# EAGLE design propdev (EAGLE 7.4.0)
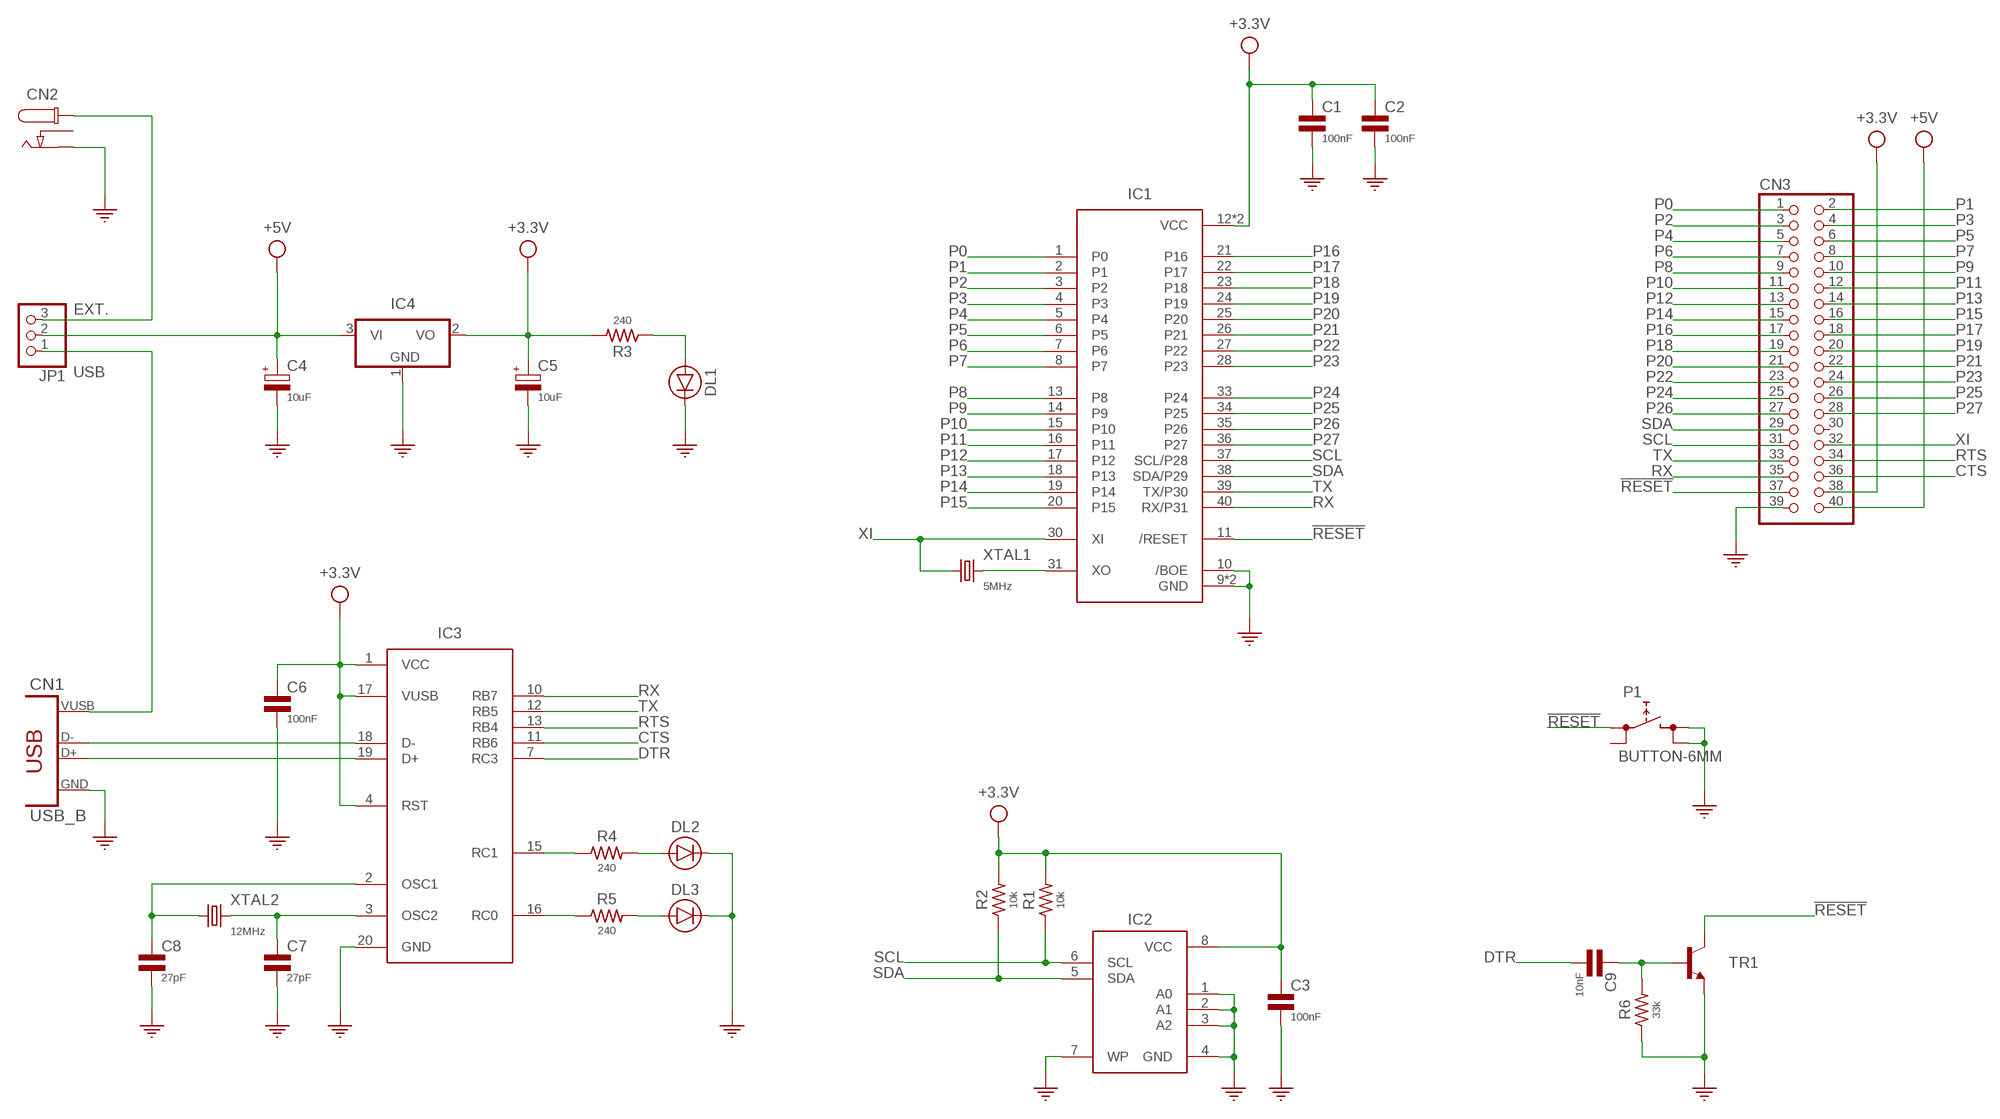
[diagram p0: schematic, sheet 1]

## Parts
C1  100nF  C  [C050-025X075]
C2  100nF  C  [C050-025X075]
C3  100nF  C  [C050-025X075]
C4  10uF  CP-2.5-6  [E2,5-6]
C5  10uF  CP-2.5-6  [E2,5-6]
C6  100nF  C  [C050-025X075]
C7  27pF  C  [C050-025X075]
C8  27pF  C  [C050-025X075]
C9  10nF  C  [C050-025X075]
CN1  USB_B  [USB-B]
CN2  DC_JACK  [PJ-102A]
CN3  PINHD-2X20B  [2X20B]
DL1  LED-3MM  [LED3MM]
DL2  LED-3MM  [LED3MM]
DL3  LED-3MM  [LED3MM]
IC1  P8X32A  [DIL40]
IC2  24LC512-I/P  [DIL08]
IC3  PIC18F14K50-I/P  [DIL20]
IC4  LM1117T-3.3  LM1117T  [TO220H]
JP1  PINHD-1X3  [1X03]
P1  BUTTON-6MM  [TL1105]
R1  10k  R-1/4W  [0207/10]
R2  10k  R-1/4W  [0207/10]
R3  240  R-1/4W  [0207/10]
R4  240  R-1/4W  [0207/10]
R5  240  R-1/4W  [0207/10]
R6  33k  R-1/4W  [0207/10]
TR1  BC547  [TO92]
XTAL1  5MHz  CRYSTAL-HC49/S  [HC49/S]
XTAL2  12MHz  CRYSTAL-HC49/S  [HC49/S]

## Nets
!RESET!: CN3.37 IC1.11(/RESET) P1.1 TR1.3(C)
+3.3V: C1.1 C2.1 C3.1 C5.+ C6.1 CN3.38 IC1.12(VCC) IC1.32(VCC) IC2.8(VCC) IC3.1(VCC) IC3.4(RST) IC3.17(VUSB) IC4.2(VO) R1.2 R2.2 R3.2
+5V: C4.+ CN3.40 IC4.3(VI) JP1.2
CTS: CN3.36 IC3.11(RB6)
DTR: C9.2 IC3.7(RC3)
EXT.: CN2.P1 JP1.3
GND: C1.2 C2.2 C3.2 C4.- C5.- C6.2 C7.2 C8.2 CN1.4(GND) CN2.P3(P2) CN3.39 DL1.K(C) DL2.K(C) DL3.K(C) IC1.9(GND) IC1.10(/BOE) IC1.29(GND) IC2.1(A0) IC2.2(A1) IC2.3(A2) IC2.4(GND) IC2.7(WP) IC3.20(GND) IC4.1(GND) P1.2 P1.4 R6.1 TR1.1(E)
N$1: IC3.16(RC0) R5.1
N$2: CN1.2(D-) IC3.18(D-)
N$3: CN1.3(D+) IC3.19(D+)
N$4: C7.1 IC3.3(OSC2) XTAL2.2
N$5: C8.1 IC3.2(OSC1) XTAL2.1
N$6: C9.1 R6.2 TR1.2(B)
N$7: DL2.A R4.2
N$8: DL3.A R5.2
N$9: IC3.15(RC1) R4.1
N$11: DL1.A R3.1
N$25: IC1.31(XO) XTAL1.2
P0: CN3.1 IC1.1(P0)
P1: CN3.2 IC1.2(P1)
P2: CN3.3 IC1.3(P2)
P3: CN3.4 IC1.4(P3)
P4: CN3.5 IC1.5(P4)
P5: CN3.6 IC1.6(P5)
P6: CN3.7 IC1.7(P6)
P7: CN3.8 IC1.8(P7)
P8: CN3.9 IC1.13(P8)
P9: CN3.10 IC1.14(P9)
P10: CN3.11 IC1.15(P10)
P11: CN3.12 IC1.16(P11)
P12: CN3.13 IC1.17(P12)
P13: CN3.14 IC1.18(P13)
P14: CN3.15 IC1.19(P14)
P15: CN3.16 IC1.20(P15)
P16: CN3.17 IC1.21(P16)
P17: CN3.18 IC1.22(P17)
P18: CN3.19 IC1.23(P18)
P19: CN3.20 IC1.24(P19)
P20: CN3.21 IC1.25(P20)
P21: CN3.22 IC1.26(P21)
P22: CN3.23 IC1.27(P22)
P23: CN3.24 IC1.28(P23)
P24: CN3.25 IC1.33(P24)
P25: CN3.26 IC1.34(P25)
P26: CN3.27 IC1.35(P26)
P27: CN3.28 IC1.36(P27)
RTS: CN3.34 IC3.13(RB4)
RX: CN3.35 IC1.40(RX/P31) IC3.10(RB7)
SCL: CN3.31 IC1.37(SCL/P28) IC2.6(SCL) R1.1
SDA: CN3.29 IC1.38(SDA/P29) IC2.5(SDA) R2.1
TX: CN3.33 IC1.39(TX/P30) IC3.12(RB5)
USB: CN1.1(VUSB) JP1.1
XI: CN3.32 IC1.30(XI) XTAL1.1
Unconnected: CN2.P2(P3) CN3.30 P1.3

## Library data of the parts
C1-C3 C6-C9 = propdev-2016:C
C4 C5 = propdev-2016:CP
CN1 = propdev-2016:USB_B: MINI USB 4 Pol.
CN2 = propdev-2016:DC_JACK: DC power connector
CN3 = propdev-2016:PINHD-2X20: PIN HEADER
DL1-DL3 = propdev-2016:LED: LED
IC1 = propdev-2016:P8X32A: Parallax Propeller
IC2 = propdev-2016:24LC*
IC3 = propdev-2016:PIC18F14K50: PIC18F14K50
IC4 = propdev-2016:LM1117
JP1 = propdev-2016:PINHD-1X3: PIN HEADER
P1 = propdev-2016:BUTTON
R1-R6 = propdev-2016:R
TR1 = propdev-2016:BC547*: NPN Transistor
XTAL1 XTAL2 = propdev-2016:CRYSTAL

## Board
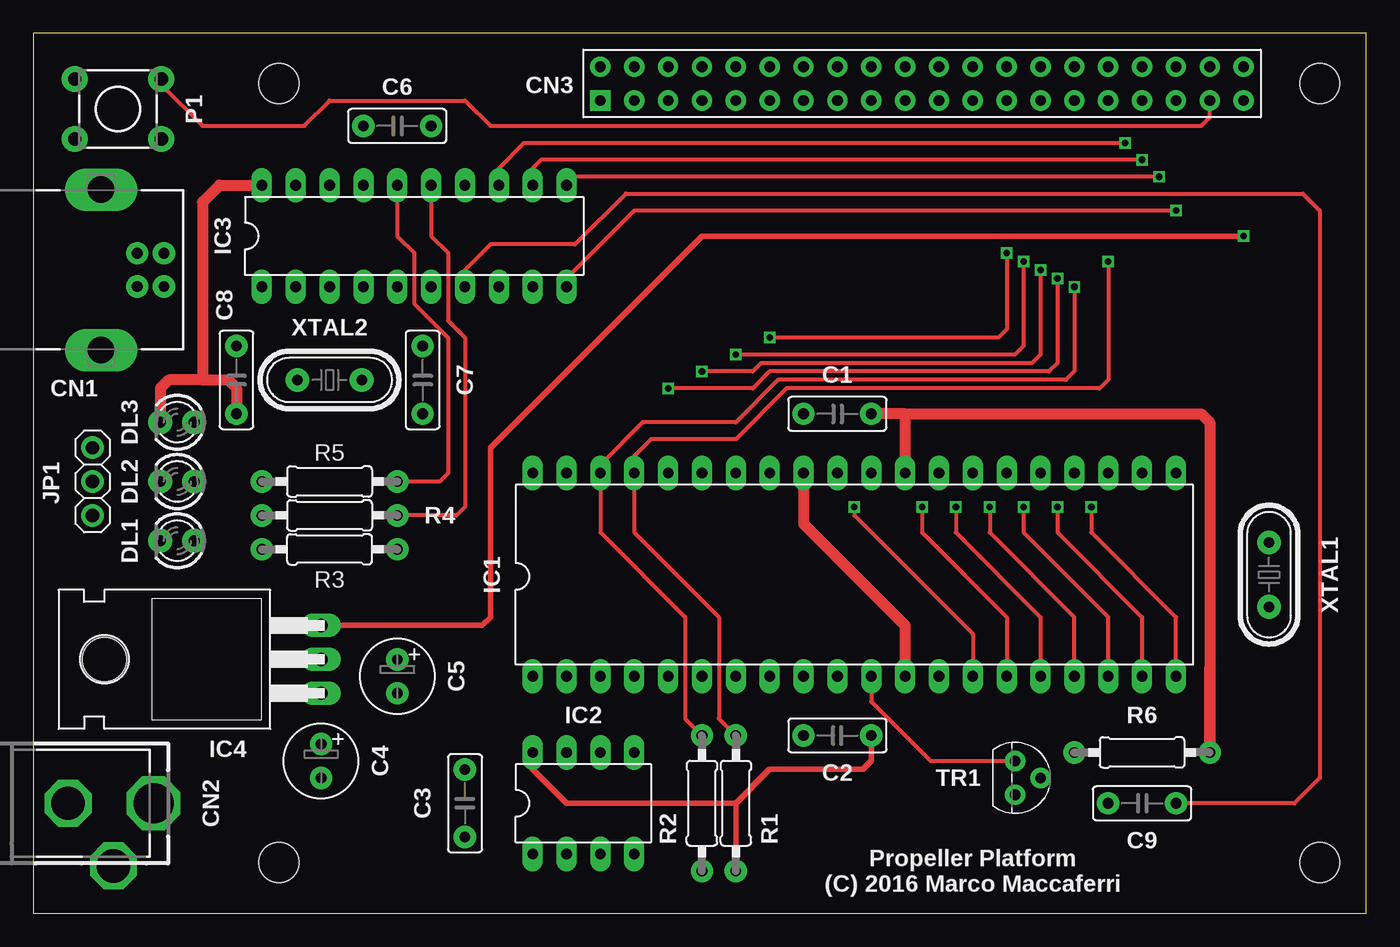
[diagram p1: board, top side]
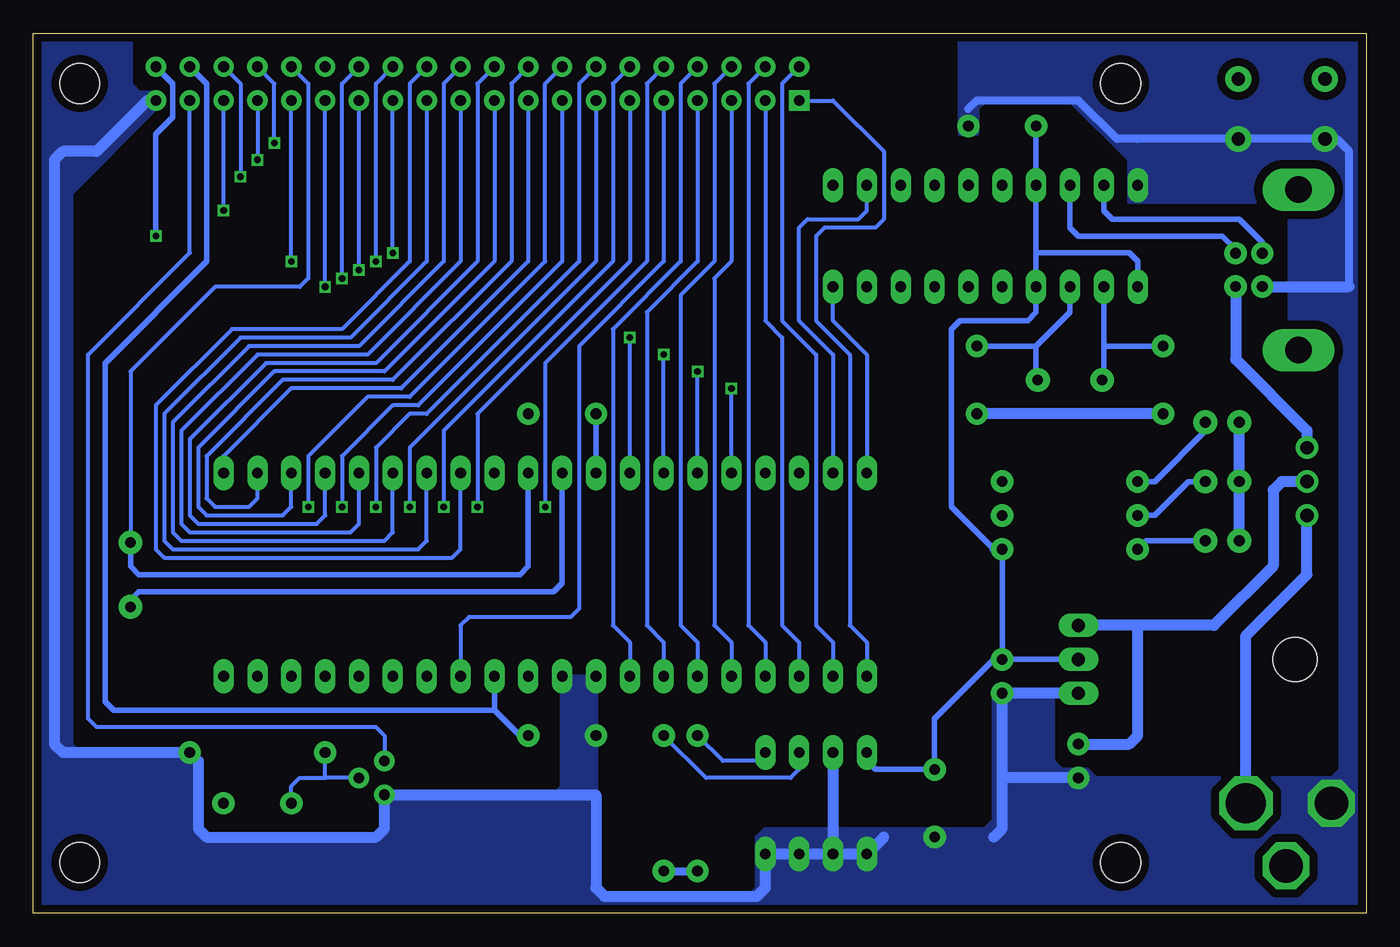
[diagram p2: board, bottom side, seen from below]

Size 100 x 66 mm. Coordinates in mm from the lower left corner, seen from the top.
Outline: 0,0 100,0 100,66 0,66 0,0
Copper layers (1*16): Top 0.0356mm / dielectric 1.5011mm / Bottom 0.0356mm
Design rules "oshpark-2layer": minimum track width 6mil, minimum drill 13mil, track to track 6mil, track to pad 6mil, pad to pad 6mil, via to via 6mil, smd to smd 6mil, copper to edge 15mil, drill to drill 6mil, minimum pad ring 7mil, minimum via ring 7mil, stop-mask expansion 2.5mil, vias tented up to drill 0mil, thermal gap 10mil
Holes 3 mm at 18.41,3.81 96.52,3.81 96.52,62.23 18.41,62.23

### Footprints (pad centres in the part's own frame; a part is rotated, then mirrored left to right if it is on the bottom)
C050-025X075 = drill 0.8 pad 1.676: 1 -2.54,0; 2 2.54,0
E2,5-6 = drill 0.8 pad 1.676: + -1.27,0; - 1.27,0
USB-B = drill 0.8 pad 1.676: 1 4.71,-1.25; 2 4.71,1.25; 3 2.71,1.25; 4 2.71,-1.25 | drill 2 pad 3.2 long: M1 0,6.02; M2 0,-6.02
PJ-102A = drill 3 octagon: P1 0,6.475 | drill 2.5 octagon: P2 4.7,3.475; P3 0,0.065
2X20B = drill 0.8 pad 1.524 square: 1 -24.13,-1.27 | drill 0.8 pad 1.524: 2 -24.13,1.27; 3 -21.59,-1.27; 4 -21.59,1.27; 5 -19.05,-1.27; 6 -19.05,1.27; 7 -16.51,-1.27; 8 -16.51,1.27; 9 -13.97,-1.27; 10 -13.97,1.27; 11 -11.43,-1.27; 12 -11.43,1.27; 13 -8.89,-1.27; 14 -8.89,1.27; 15 -6.35,-1.27; 16 -6.35,1.27; 17 -3.81,-1.27; 18 -3.81,1.27; 19 -1.27,-1.27; 20 -1.27,1.27; 21 1.27,-1.27; 22 1.27,1.27; 23 3.81,-1.27; 24 3.81,1.27; 25 6.35,-1.27; 26 6.35,1.27; 27 8.89,-1.27; 28 8.89,1.27; 29 11.43,-1.27; 30 11.43,1.27; 31 13.97,-1.27; 32 13.97,1.27; 33 16.51,-1.27; 34 16.51,1.27; 35 19.05,-1.27; 36 19.05,1.27; 37 21.59,-1.27; 38 21.59,1.27; 39 24.13,-1.27; 40 24.13,1.27
LED3MM = drill 0.8 pad 1.778: A -1.27,0; K 1.27,0
DIL40 = drill 0.8 pad 1.524 long: 1 -24.13,-7.62; 2 -21.59,-7.62; 3 -19.05,-7.62; 4 -16.51,-7.62; 5 -13.97,-7.62; 6 -11.43,-7.62; 7 -8.89,-7.62; 8 -6.35,-7.62; 9 -3.81,-7.62; 10 -1.27,-7.62; 11 1.27,-7.62; 12 3.81,-7.62; 13 6.35,-7.62; 14 8.89,-7.62; 15 11.43,-7.62; 16 13.97,-7.62; 17 16.51,-7.62; 18 19.05,-7.62; 19 21.59,-7.62; 20 24.13,-7.62; 21 24.13,7.62; 22 21.59,7.62; 23 19.05,7.62; 24 16.51,7.62; 25 13.97,7.62; 26 11.43,7.62; 27 8.89,7.62; 28 6.35,7.62; 29 3.81,7.62; 30 1.27,7.62; 31 -1.27,7.62; 32 -3.81,7.62; 33 -6.35,7.62; 34 -8.89,7.62; 35 -11.43,7.62; 36 -13.97,7.62; 37 -16.51,7.62; 38 -19.05,7.62; 39 -21.59,7.62; 40 -24.13,7.62
DIL08 = drill 0.8 pad 1.524 long: 1 -3.81,-3.81; 2 -1.27,-3.81; 3 1.27,-3.81; 4 3.81,-3.81; 5 3.81,3.81; 6 1.27,3.81; 7 -1.27,3.81; 8 -3.81,3.81
DIL20 = drill 0.8 pad 1.524 long: 1 -11.43,-3.81; 2 -8.89,-3.81; 3 -6.35,-3.81; 4 -3.81,-3.81; 5 -1.27,-3.81; 6 1.27,-3.81; 7 3.81,-3.81; 8 6.35,-3.81; 9 8.89,-3.81; 10 11.43,-3.81; 11 11.43,3.81; 12 8.89,3.81; 13 6.35,3.81; 14 3.81,3.81; 15 1.27,3.81; 16 -1.27,3.81; 17 -3.81,3.81; 18 -6.35,3.81; 19 -8.89,3.81; 20 -11.43,3.81
TO220H = drill 1 pad 1.778 long: 1 -2.54,-11.43; 2 0,-11.43; 3 2.54,-11.43 | hole 3.302: 0,4.826
1X03 = drill 1 pad 1.676: 1 -2.54,0; 2 0,0; 3 2.54,0
TL1105 = drill 1 pad 1.93: 1 -3.25,-2.25; 2 -3.25,2.25; 3 3.25,-2.25; 4 3.25,2.25
0207/10 = drill 0.8 pad 1.676: 1 -5.08,0; 2 5.08,0
TO92 = drill 0.8 pad 1.524: 1 1.27,0; 2 0,1.905; 3 -1.27,0
HC49/S = drill 0.8 pad 1.778: 1 -2.413,0; 2 2.413,0

### Placement (x,y rotation side)
C1  60.33,37.47 0 top
C2  60.33,13.34 180 top
C3  32.38,8.26 270 top
C4  21.59,11.43 270 top
C5  27.3,17.78 270 top
C6  27.3,59.05 0 top
C7  29.21,40.01 270 top
C8  15.24,40.01 270 top
C9  83.19,8.26 0 top
CN1  5.08,48.26 0 top
CN2  2.54,8.26 270 top
CN3  66.67,62.23 0 top
DL1  10.79,27.94 180 top
DL2  10.79,32.38 180 top
DL3  10.79,36.83 180 top
IC1  61.59,25.4 0 top
IC2  41.27,8.26 0 top
IC3  28.57,50.8 0 top
IC4  10.16,19.05 90 top
JP1  4.45,32.38 270 top
P1  6.35,60.33 180 top
R1  52.7,8.26 270 top
R2  50.16,8.26 270 top
R3  22.23,27.3 0 top
R4  22.23,29.84 180 top
R5  22.23,32.38 180 top
R6  83.19,12.06 180 top
TR1  73.66,10.16 270 top
XTAL1  92.71,25.4 270 top
XTAL2  22.23,40.01 0 top

### Tracks (layer width: path | path; a pad name or v marks a point on that pad's centre or on a via)
!RESET!
  Top 0.305: P1.1 9.6,62.16 12.7,59.05 20.32,59.05 22.23,60.96 32.38,60.96 34.29,59.05 87.63,59.05 88.27,59.69 CN3.37 | IC1.11 62.87,15.88 67.31,11.43 TR1.3
  Bottom 0.305: CN3.37 88.27,49.53 95.89,41.91 95.89,14.61 95.25,13.97 74.3,13.97 73.66,13.34 TR1.3
+3.3V
  Top 0.406: 52.7,8.26 40.01,8.26 37.47,10.79 IC2.8 | R1.2 52.7,8.26 | 52.7,8.26 55.24,10.79 62.23,10.79 62.87,11.43 C2.1
  Top 0.813: IC1.32 57.78,29.21 65.41,21.59 IC1.12
  Bottom 0.406: 24.77,49.53 IC3.17 C6.1 | 24.77,49.53 IC3.4 24.77,45.09 25.4,44.45 30.48,44.45 31.11,43.81 31.11,30.48 27.94,27.3 | R3.2 C5.+ | 65.41,15.24 93.98,15.24 94.61,15.88 94.61,41.27 87,48.9 87,62.23 CN3.38 | IC4.2 C5.+ | 24.77,49.53 17.78,49.53 17.14,48.9 IC3.1 | C5.+ 27.94,19.05 32.38,14.61 C3.1 36.83,10.79 37.47,11.43 | 65.41,15.24 63.5,13.34 C2.1 | 65.41,15.24 IC1.12 | C1.1 IC1.32
  Bottom 0.61: R1.2 R2.2 | 27.94,27.3 R3.2 | 37.47,11.43 IC2.8
+5V  (via drill 0.5)
  Top 0.406: v90.81,50.8 50.16,50.8 34.29,34.92 34.29,22.23 33.66,21.59 IC4.3
  Bottom 0.406: CN3.40 89.53,62.23 89.53,59.69 90.81,58.42 v90.81,50.8
  Bottom 0.813: C4.+ 17.78,12.7 17.14,13.34 17.14,21.59 | 17.14,21.59 IC4.3 | JP1.2 6.35,32.38 6.99,31.75 6.99,26.04 11.43,21.59 17.14,21.59
CTS  (via drill 0.5)
  Top 0.305: v84.45,55.24 40.64,55.24 IC3.11
  Bottom 0.305: CN3.36 84.45,62.23 v84.45,55.24
DTR
  Top 0.305: C9.2 94.61,8.26 96.52,10.16 96.52,52.7 95.25,53.98 44.45,53.98 40.64,50.16 34.29,50.16 32.38,48.26 IC3.7
EXT.
  Bottom 0.813: CN2.P1 9.02,20.83 4.45,25.4 JP1.3
GND
  Top 0.813: 65.41,37.47 87.63,37.47 88.27,36.83 R6.1 88.27,18.41 | 12.7,40.01 12.7,53.34 13.97,54.61 IC3.20 | 12.7,40.01 14.61,40.01 15.24,39.37 C8.2 | 12.7,40.01 10.16,40.01 9.53,39.37 DL3.K | 65.41,37.47 IC1.29 | 65.41,37.47 C1.2
  Bottom 0.61: 29.84,60.33 29.21,60.96 21.59,60.96 18.7,58.08 17.14,58.08 P1.2 P1.4 2.19,58.08 1.27,57.15 1.27,46.99 1.29,47.01 | R6.1 87.63,11.43
  Bottom 0.813: 36.2,5.71 IC2.1 IC2.2 | C8.2 C7.2 | DL1.K DL2.K DL3.K | IC4.1 C5.- 27.3,10.16 | 27.94,5.71 27.3,6.35 27.3,10.16 | C4.- 27.3,10.16 | 87.63,11.43 87.63,6.35 87,5.71 74.3,5.71 73.66,6.35 TR1.1 57.78,8.89 57.78,1.91 57.15,1.27 45.72,1.27 45.09,1.91 IC2.4 IC2.3 IC2.2 | CN3.39 91.44,60.96 95.25,57.15 97.79,57.15 98.42,56.52 98.42,12.7 97.79,12.06 R6.1 | CN1.4 1.29,47.01 | IC2.7 IC2.2
  pour Bottom (isolate 0.61, no thermals): 0,0 100.33,0 100.33,66.04 92.71,66.04 92.71,62.23 92.08,61.59 90.81,61.59 90.81,60.33 97.16,53.98 97.16,12.7 96.52,12.06 88.27,12.06 87.63,11.43 87.63,6.35 87,5.71 74.3,5.71 73.66,6.35 73.66,8.89 60.96,8.89 60.33,9.53 60.33,17.78 57.78,17.78 57.78,1.91 57.15,1.27 46.35,1.27 45.72,1.91 45.72,5.71 45.09,6.35 28.57,6.35 27.94,6.99 27.94,16.51 23.5,16.51 23.5,11.43 22.86,10.79 20.95,10.79 20.32,10.16 2.54,10.16 1.91,10.79 1.91,41.91 5.71,41.91 5.71,53.34 17.78,53.34 17.78,56.52 22.23,60.96 28.57,60.96 29.21,60.33 29.21,58.42 30.48,58.42 30.48,66.04 0,66.04
N$1
  Top 0.305: R5.1 30.48,32.38 31.11,33.02 31.11,43.18 28.57,45.72 28.57,49.53 27.3,50.8 IC3.16
N$2
  Bottom 0.305: CN1.2 9.79,49.8
  Bottom 0.406: 9.79,49.8 10.79,50.8 21.59,50.8 22.23,51.44 IC3.18
N$3
  Bottom 0.406: IC3.19 19.68,52.7 19.05,52.07 9.53,52.07 7.79,50.34 CN1.3
N$4
  Bottom 0.406: C7.1 24.77,42.55 | 24.77,42.55 22.23,45.09 IC3.3 | 24.77,42.55 24.77,40.13
  Bottom 0.61: 24.77,40.13 XTAL2.2
N$5
  Bottom 0.406: C8.1 19.68,42.55 | 19.68,42.55 IC3.2 | 19.68,42.55 19.68,40.13
  Bottom 0.61: 19.68,40.13 XTAL2.1
N$6
  Bottom 0.305: TR1.2 78.11,10.16 | 78.11,10.16 R6.2 | C9.1 80.64,9.53 80.01,10.16 78.11,10.16
N$7
  Bottom 0.406: DL2.A 13.34,32.38 15.88,29.84 R4.2
N$8
  Bottom 0.406: DL3.A 12.06,36.2 15.88,32.38 R5.2
N$9
  Top 0.305: R4.1 31.75,29.84 32.38,30.48 32.38,43.18 31.11,44.45 31.11,49.53 29.84,50.8 IC3.15
N$11
  Bottom 0.406: DL1.A 16.51,27.94 R3.1
N$25
  Bottom 0.406: IC1.31 60.33,24.77 60.96,24.13 92.08,24.13 92.71,23.5 XTAL1.2
P0
  Bottom 0.305: IC1.1 37.47,20.32 38.73,21.59 38.73,41.91 41.27,44.45 41.27,50.8 40.64,51.44 36.83,51.44 36.2,52.07 36.2,57.15 40.01,60.96 CN3.1
P1
  Bottom 0.305: CN3.2 43.81,62.23 43.81,44.45 41.27,41.91 41.27,21.59 40.01,20.32 IC1.2
P2
  Bottom 0.305: CN3.3 45.09,44.45 43.81,43.18 43.81,21.59 42.55,20.32 IC1.3
P3
  Bottom 0.305: CN3.4 46.35,62.23 46.35,21.59 45.09,20.32 IC1.4
P4
  Bottom 0.305: CN3.5 47.62,48.9 48.9,47.62 48.9,21.59 47.62,20.32 IC1.5
P5
  Bottom 0.305: CN3.6 48.9,62.23 48.9,48.9 51.44,46.35 51.44,21.59 50.16,20.32 IC1.6
P6
  Bottom 0.305: CN3.7 50.16,48.9 53.98,45.09 53.98,21.59 52.7,20.32 IC1.7
P7
  Bottom 0.305: CN3.8 51.44,62.23 51.44,48.9 56.52,43.81 56.52,21.59 55.24,20.32 IC1.8
P8
  Bottom 0.305: CN3.9 52.7,48.9 59.05,42.55 59.05,22.86 59.69,22.23 67.31,22.23 67.94,21.59 IC1.13
P9  (via drill 0.5)
  Top 0.305: IC1.14 70.48,20.95 61.59,29.84 v61.59,30.48
  Bottom 0.305: CN3.10 53.98,62.23 53.98,48.9 61.59,41.27 v61.59,30.48
P10  (via drill 0.5)
  Top 0.305: IC1.15 73.03,22.23 66.67,28.57 v66.67,30.48
  Bottom 0.305: CN3.11 55.24,48.9 66.67,37.47 v66.67,30.48
P11  (via drill 0.5)
  Top 0.305: IC1.16 75.56,22.23 69.22,28.57 v69.22,30.48
  Bottom 0.305: CN3.12 56.52,62.23 56.52,48.9 69.22,36.2 v69.22,30.48
P12  (via drill 0.5)
  Top 0.305: IC1.17 78.11,22.23 71.75,28.57 v71.75,30.48
  Bottom 0.305: CN3.13 57.78,48.9 71.75,34.92 v71.75,30.48
P13  (via drill 0.5)
  Top 0.305: IC1.18 80.64,22.23 74.3,28.57 v74.3,30.48
  Bottom 0.305: CN3.14 59.05,62.23 59.05,48.9 70.48,37.47 71.75,37.47 74.3,34.92 v74.3,30.48
P14  (via drill 0.5)
  Top 0.305: IC1.19 83.19,22.23 76.83,28.57 v76.83,30.48
  Bottom 0.305: CN3.15 60.33,48.9 71.12,38.1 73.03,38.1 76.83,34.29 v76.83,30.48
P15  (via drill 0.5)
  Top 0.305: IC1.20 85.72,22.23 79.38,28.57 v79.38,30.48
  Bottom 0.305: CN3.16 61.59,62.23 61.59,48.9 71.75,38.73 74.93,38.73 79.38,34.29 v79.38,30.48
P16
  Bottom 0.305: CN3.17 62.87,48.9 72.39,39.37 80.64,39.37 85.72,34.29 IC1.21
P17
  Bottom 0.305: CN3.18 64.14,62.23 64.14,48.9 73.03,40.01 81.28,40.01 87,34.29 87,31.11 86.36,30.48 83.82,30.48 83.19,31.11 IC1.22
P18
  Bottom 0.305: CN3.19 65.41,48.9 73.66,40.64 81.92,40.64 87.63,34.92 87.63,30.48 87,29.84 81.28,29.84 80.64,30.48 IC1.23
P19
  Bottom 0.305: CN3.20 66.67,62.23 66.67,48.9 74.3,41.27 82.55,41.27 88.27,35.56 88.27,29.84 87.63,29.21 78.74,29.21 78.11,29.84 IC1.24
P20
  Bottom 0.305: CN3.21 67.94,48.9 74.93,41.91 83.19,41.91 88.9,36.2 88.9,29.21 88.27,28.57 76.2,28.57 75.56,29.21 IC1.25
P21
  Bottom 0.305: CN3.22 69.22,62.23 69.22,48.9 75.56,42.55 83.82,42.55 89.53,36.83 89.53,28.57 88.9,27.94 73.66,27.94 73.03,28.57 IC1.26
P22
  Bottom 0.305: CN3.23 70.48,48.9 76.2,43.18 84.45,43.18 90.17,37.47 90.17,27.94 89.53,27.3 71.12,27.3 70.48,27.94 IC1.27
P23
  Bottom 0.305: CN3.24 71.75,62.23 71.75,48.9 76.83,43.81 85.09,43.81 90.81,38.1 90.81,27.3 90.17,26.67 68.58,26.67 67.94,27.3 IC1.28
P24  (via drill 0.5)
  Top 0.305: v73.03,49.53 73.03,43.81 72.39,43.18 v55.24,43.18
  Bottom 0.305: IC1.33 v55.24,43.18 | v73.03,49.53 CN3.25
P25  (via drill 0.5)
  Top 0.305: v74.3,48.9 74.3,42.55 73.66,41.91 v52.7,41.91
  Bottom 0.305: IC1.34 v52.7,41.91 | v74.3,48.9 74.3,62.23 CN3.26
P26  (via drill 0.5)
  Top 0.305: v75.56,48.26 75.56,41.91 74.93,41.27 54.61,41.27 53.98,40.64 v50.16,40.64
  Bottom 0.305: IC1.35 v50.16,40.64 | v75.56,48.26 CN3.27
P27  (via drill 0.5)
  Top 0.305: v76.83,47.62 76.83,41.27 76.2,40.64 55.24,40.64 53.98,39.37 v47.62,39.37
  Bottom 0.305: IC1.36 v47.62,39.37 | v76.83,47.62 76.83,62.23 CN3.28
RTS  (via drill 0.5)
  Top 0.305: v81.92,57.78 36.83,57.78 34.92,55.88 IC3.13
  Bottom 0.305: v81.92,57.78 81.92,62.23 CN3.34
RX  (via drill 0.5)
  Top 0.305: v85.72,52.7 45.09,52.7 40.01,47.62 IC3.10
  Bottom 0.305: v85.72,52.7 CN3.35 | IC1.40 37.47,41.91 40.01,44.45 IC3.10
SCL  (via drill 0.5)
  Top 0.305: v80.64,48.9 80.64,40.01 80.01,39.37 56.52,39.37 52.7,35.56 46.35,35.56 45.09,34.29 IC1.37 45.09,28.57 51.44,22.23 51.44,14.61 R1.1
  Bottom 0.305: v80.64,48.9 CN3.31 | IC2.6 42.55,10.79 43.18,10.16 49.53,10.16 R1.1
SDA  (via drill 0.5)
  Top 0.305: v78.11,46.99 78.11,40.64 77.47,40.01 55.88,40.01 52.7,36.83 45.72,36.83 42.55,33.66 IC1.38 42.55,28.57 48.9,22.23 48.9,14.61 R2.1
  Bottom 0.305: v78.11,46.99 CN3.29 | IC2.5 45.72,11.43 48.26,11.43 R2.1
TX  (via drill 0.5)
  Top 0.305: v83.19,56.52 38.1,56.52 37.47,55.88 IC3.12
  Bottom 0.305: IC1.39 40.01,41.91 42.55,44.45 42.55,51.44 41.91,52.07 38.1,52.07 37.47,52.7 IC3.12 | CN3.33 v83.19,56.52
USB
  Bottom 0.813: CN1.1 9.79,41.54 4.45,36.2 JP1.1
XI
  Bottom 0.305: CN3.32 79.38,62.23 79.38,47.62 80.01,46.99 86.36,46.99 92.71,40.64 XTAL1.1
  Bottom 0.406: XTAL1.1 92.71,26.04 92.08,25.4 63.5,25.4 62.87,26.04 IC1.30

### Text on the board
tPlace: Propeller Platform / (C) 2016 Marco Maccaferri